# Altium project PCB_Project1.PrjPCB
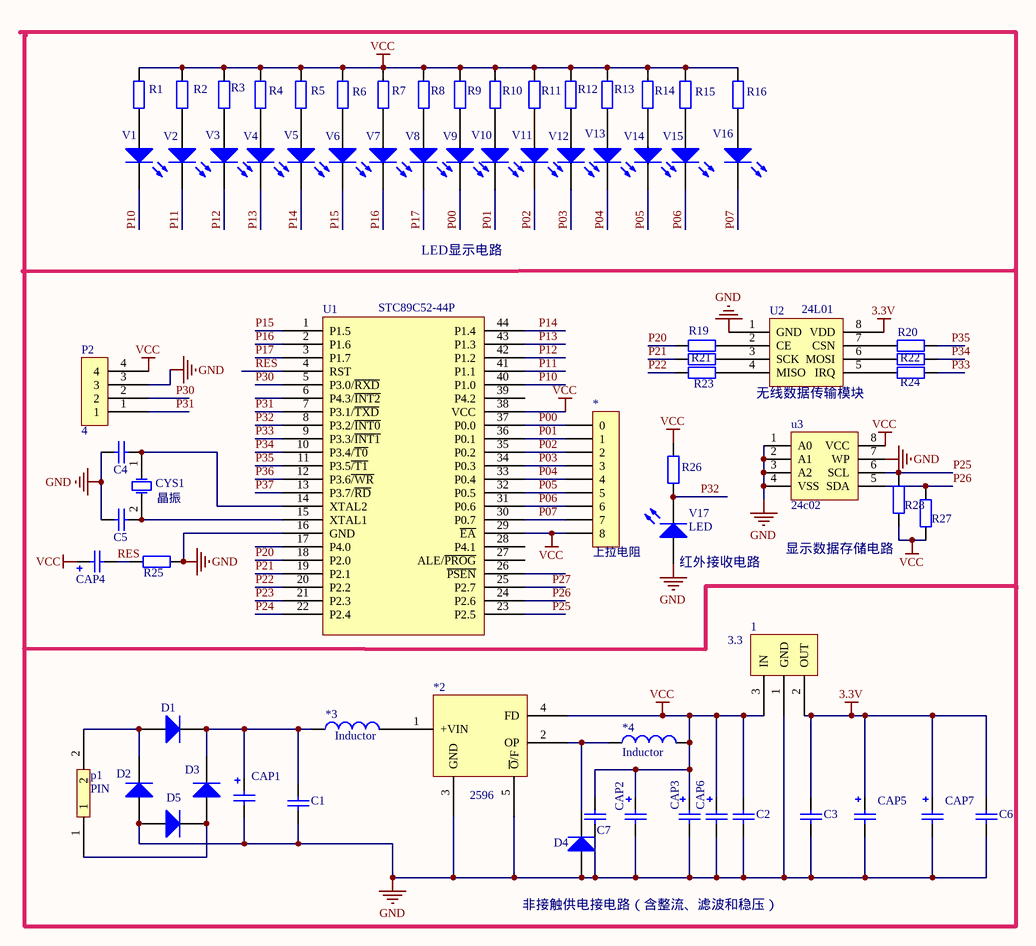
[diagram p0: Sheet1.SchDoc]
1 sheet, 73 parts. Net scope: global (net labels, ports and power ports of the same name join across sheets).
Board file: PCB1.PcbDoc

## Sheet Sheet1.SchDoc
size A3

### Parts
1  3.3  [3.3]
*  上拉电阻  [上拉电阻]
*2  2596  [LM2596-P]
*3  Inductor  [PIN]
*4  Inductor  [PIN]
C1  Cap  [RES]  (value not drawn)
C2  Cap  [C - duplicate]  (value not drawn)
C3  Cap  [C - duplicate]  (value not drawn)
C4  Cap  [C - duplicate]  (value not drawn)
C5  Cap  [C - duplicate]  (value not drawn)
C6  Cap  [C - duplicate]  (value not drawn)
C7  Cap  [C - duplicate]  (value not drawn)
CAP1  电解小电容  [C]  (value not drawn)
CAP2  电解小电容  [C]  (value not drawn)
CAP3  电解小电容  [CAP - duplicate]  (value not drawn)
CAP4  电解小电容  [CAP - duplicate]  (value not drawn)
CAP5  电解小电容  [CAP - duplicate]  (value not drawn)
CAP6  电解小电容  [CAP - duplicate]  (value not drawn)
CAP7  电解小电容  [电解小电容]  (value not drawn)
CYS1  晶振  [晶振-p]
D1  二极管  [IN4148]  (value not drawn)
D2  二极管  [IN4148]  (value not drawn)
D3  二极管  [IN4148]  (value not drawn)
D4  二极管  [1N4001]  (value not drawn)
D5  二极管  [IN4148]  (value not drawn)
p1  PIN  [PIN]
P2  4  [4]
R1  电阻  [C - duplicate]  (value not drawn)
R2  电阻  [C - duplicate]  (value not drawn)
R3  电阻  [C - duplicate]  (value not drawn)
R4  电阻  [C - duplicate]  (value not drawn)
R5  电阻  [C - duplicate]  (value not drawn)
R6  电阻  [C - duplicate]  (value not drawn)
R7  电阻  [C - duplicate]  (value not drawn)
R8  电阻  [C - duplicate]  (value not drawn)
R9  电阻  [C - duplicate]  (value not drawn)
R10  电阻  [C - duplicate]  (value not drawn)
R11  电阻  [C - duplicate]  (value not drawn)
R12  电阻  [C - duplicate]  (value not drawn)
R13  电阻  [C - duplicate]  (value not drawn)
R14  电阻  [C - duplicate]  (value not drawn)
R15  电阻  [C - duplicate]  (value not drawn)
R16  电阻  [C - duplicate]  (value not drawn)
R19  电阻  [C - duplicate]  (value not drawn)
R20  电阻  [C - duplicate]  (value not drawn)
R21  电阻  [C - duplicate]  (value not drawn)
R22  电阻  [C - duplicate]  (value not drawn)
R23  电阻  [C - duplicate]  (value not drawn)
R24  电阻  [C - duplicate]  (value not drawn)
R25  电阻  [C - duplicate]  (value not drawn)
R26  电阻  [RES]  (value not drawn)
R27  电阻  [RES]  (value not drawn)
R28  电阻  [RES]  (value not drawn)
U1  STC89C52-44P  [LCC44 - duplicate]
U2  24L01  [24L01]
u3  24c02  [24C02]
V1  LED  [C - duplicate]  (value not drawn)
V2  LED  [C - duplicate]  (value not drawn)
V3  LED  [C - duplicate]  (value not drawn)
V4  LED  [C - duplicate]  (value not drawn)
V5  LED  [C - duplicate]  (value not drawn)
V6  LED  [C - duplicate]  (value not drawn)
V7  LED  [C - duplicate]  (value not drawn)
V8  LED  [C - duplicate]  (value not drawn)
V9  LED  [C - duplicate]  (value not drawn)
V10  LED  [C - duplicate]  (value not drawn)
V11  LED  [C - duplicate]  (value not drawn)
V12  LED  [C - duplicate]  (value not drawn)
V13  LED  [C - duplicate]  (value not drawn)
V14  LED  [C - duplicate]  (value not drawn)
V15  LED  [C - duplicate]  (value not drawn)
V16  LED  [C - duplicate]  (value not drawn)
V17  LED  [LED]

### Nets
3.3V: 1.2(OUT) C3.2 C6.2 CAP5.2 CAP7.2 U2.8(VDD)
GND: 1.1(GND) *2.3(GND) *2.5(~{O}/F) C1.1 C2.1 C3.1 C4.2 C5.2 C6.1 C7.1 CAP1.1 CAP2.1 CAP3.1 CAP5.1 CAP6.1 CAP7.1 D2.1(A) D4.1(A) D5.1(A) P2.3 R25.2 U1.16(GND) U2.1(GND) u3.1(A0) u3.2(A1) u3.3(A2) u3.4(VSS) u3.7(WP) V17.1(A)
VCC: 1.3(IN) *.8 *2.4(FD) *4.2 C2.2 C7.2 CAP2.2 CAP3.2 CAP4.2 CAP6.2 P2.4 R1.2 R2.2 R3.2 R4.2 R5.2 R6.2 R7.2 R8.2 R9.2 R10.2 R11.2 R12.2 R13.2 R14.2 R15.2 R16.2 R26.1 R27.2 R28.2 U1.29(~{EA}) U1.38(VCC) u3.8(VCC)
P00: *.0 U1.37(P0.0) V9.2(K)
P01: *.1 U1.36(P0.1) V10.2(K)
P02: *.2 U1.35(P0.2) V11.2(K)
P03: *.3 U1.34(P0.3) V12.2(K)
P04: *.4 U1.33(P0.4) V13.2(K)
P05: *.5 U1.32(P0.5) V14.2(K)
P06: *.6 U1.31(P0.6) V15.2(K)
P07: *.7 U1.30(P0.7) V16.2(K)
P10: U1.40(P1.0) V1.2(K)
P11: U1.41(P1.1) V2.2(K)
P12: U1.42(P1.2) V3.2(K)
P13: U1.43(P1.3) V4.2(K)
P14: U1.44(P1.4) V5.2(K)
P15: U1.1(P1.5) V6.2(K)
P16: U1.2(P1.6) V7.2(K)
P17: U1.3(P1.7) V8.2(K)
P20: R19.2 U1.18(P2.0)
P21: R21.2 U1.19(P2.1)
P22: R23.2 U1.20(P2.2)
P23: U1.21(P2.3)
P24: U1.22(P2.4)
P25: R28.1 U1.23(P2.5) u3.6(SCL)
P26: R27.1 U1.24(P2.6) u3.5(SDA)
P27: U1.25(P2.7)
P30: P2.2 U1.5(P3.0/~{RXD})
P31: P2.1 U1.7(P3.1/~{TXD})
P32: R26.2 U1.8(P3.2/~{INT0}) V17.2(K)
P33: R24.1 U1.9(P3.3/~{INT1})
P34: R22.1 U1.10(P3.4/~{T0})
P35: R20.1 U1.11(P3.5~{/T1})
P36: U1.12(P3.6~{/WR})
P37: U1.13(P3.7/~{RD})
RES: CAP4.1 R25.1 U1.4(RST)
Net*2_1: *2.1(+VIN) *3.2
Net*2_2: *2.2(OP) *4.1 D4.2(K)
Net*3_1: *3.1 C1.2 CAP1.2 D1.2(K) D3.2(K)
NetC4_1: C4.1 CYS1.1(CRYSTAL) U1.14(XTAL2)
NetC5_1: C5.1 CYS1.2(CRYSTAL) U1.15(XTAL1)
NetD1_1: D1.1(A) D2.2(K) p1.2
NetD3_1: D3.1(A) D5.2(K) p1.1
NetR1_1: R1.1 V1.1(A)
NetR2_1: R2.1 V2.1(A)
NetR3_1: R3.1 V3.1(A)
NetR4_1: R4.1 V4.1(A)
NetR5_1: R5.1 V5.1(A)
NetR6_1: R6.1 V6.1(A)
NetR7_1: R7.1 V7.1(A)
NetR8_1: R8.1 V8.1(A)
NetR9_1: R9.1 V9.1(A)
NetR10_1: R10.1 V10.1(A)
NetR11_1: R11.1 V11.1(A)
NetR12_1: R12.1 V12.1(A)
NetR13_1: R13.1 V13.1(A)
NetR14_1: R14.1 V14.1(A)
NetR15_1: R15.1 V15.1(A)
NetR16_1: R16.1 V16.1(A)
NetR19_1: R19.1 U2.2(CE)
NetR20_2: R20.2 U2.7(CSN)
NetR21_1: R21.1 U2.3(SCK)
NetR22_2: R22.2 U2.6(MOSI)
NetR23_1: R23.1 U2.4(MISO)
NetR24_2: R24.2 U2.5(IRQ)

Not connected (* = marked no-connect by the designer): U1 6(P4.3/~{INT2}) 17(P4.0) 26(~{PSEN}) 27(ALE/~{PROG}) 28(P4.1) 39(P4.2)

### Notes on the sheet
- LED显示电路
- (near U2) 无线数据传输模块
- (near V17) 红外接收电路
- 显示数据存储电路
- 非接触供电接电路（含整流、滤波和稳压）
- (in symbol 电阻) 1k